# Altium schematic sheet USB_HUB1 UP PORT0.SchDoc: USB_HUB 3.0
size A3; DrawnBy: Luca Schenetti; Revision: A; SheetNumber: 5; SheetTotal: 10
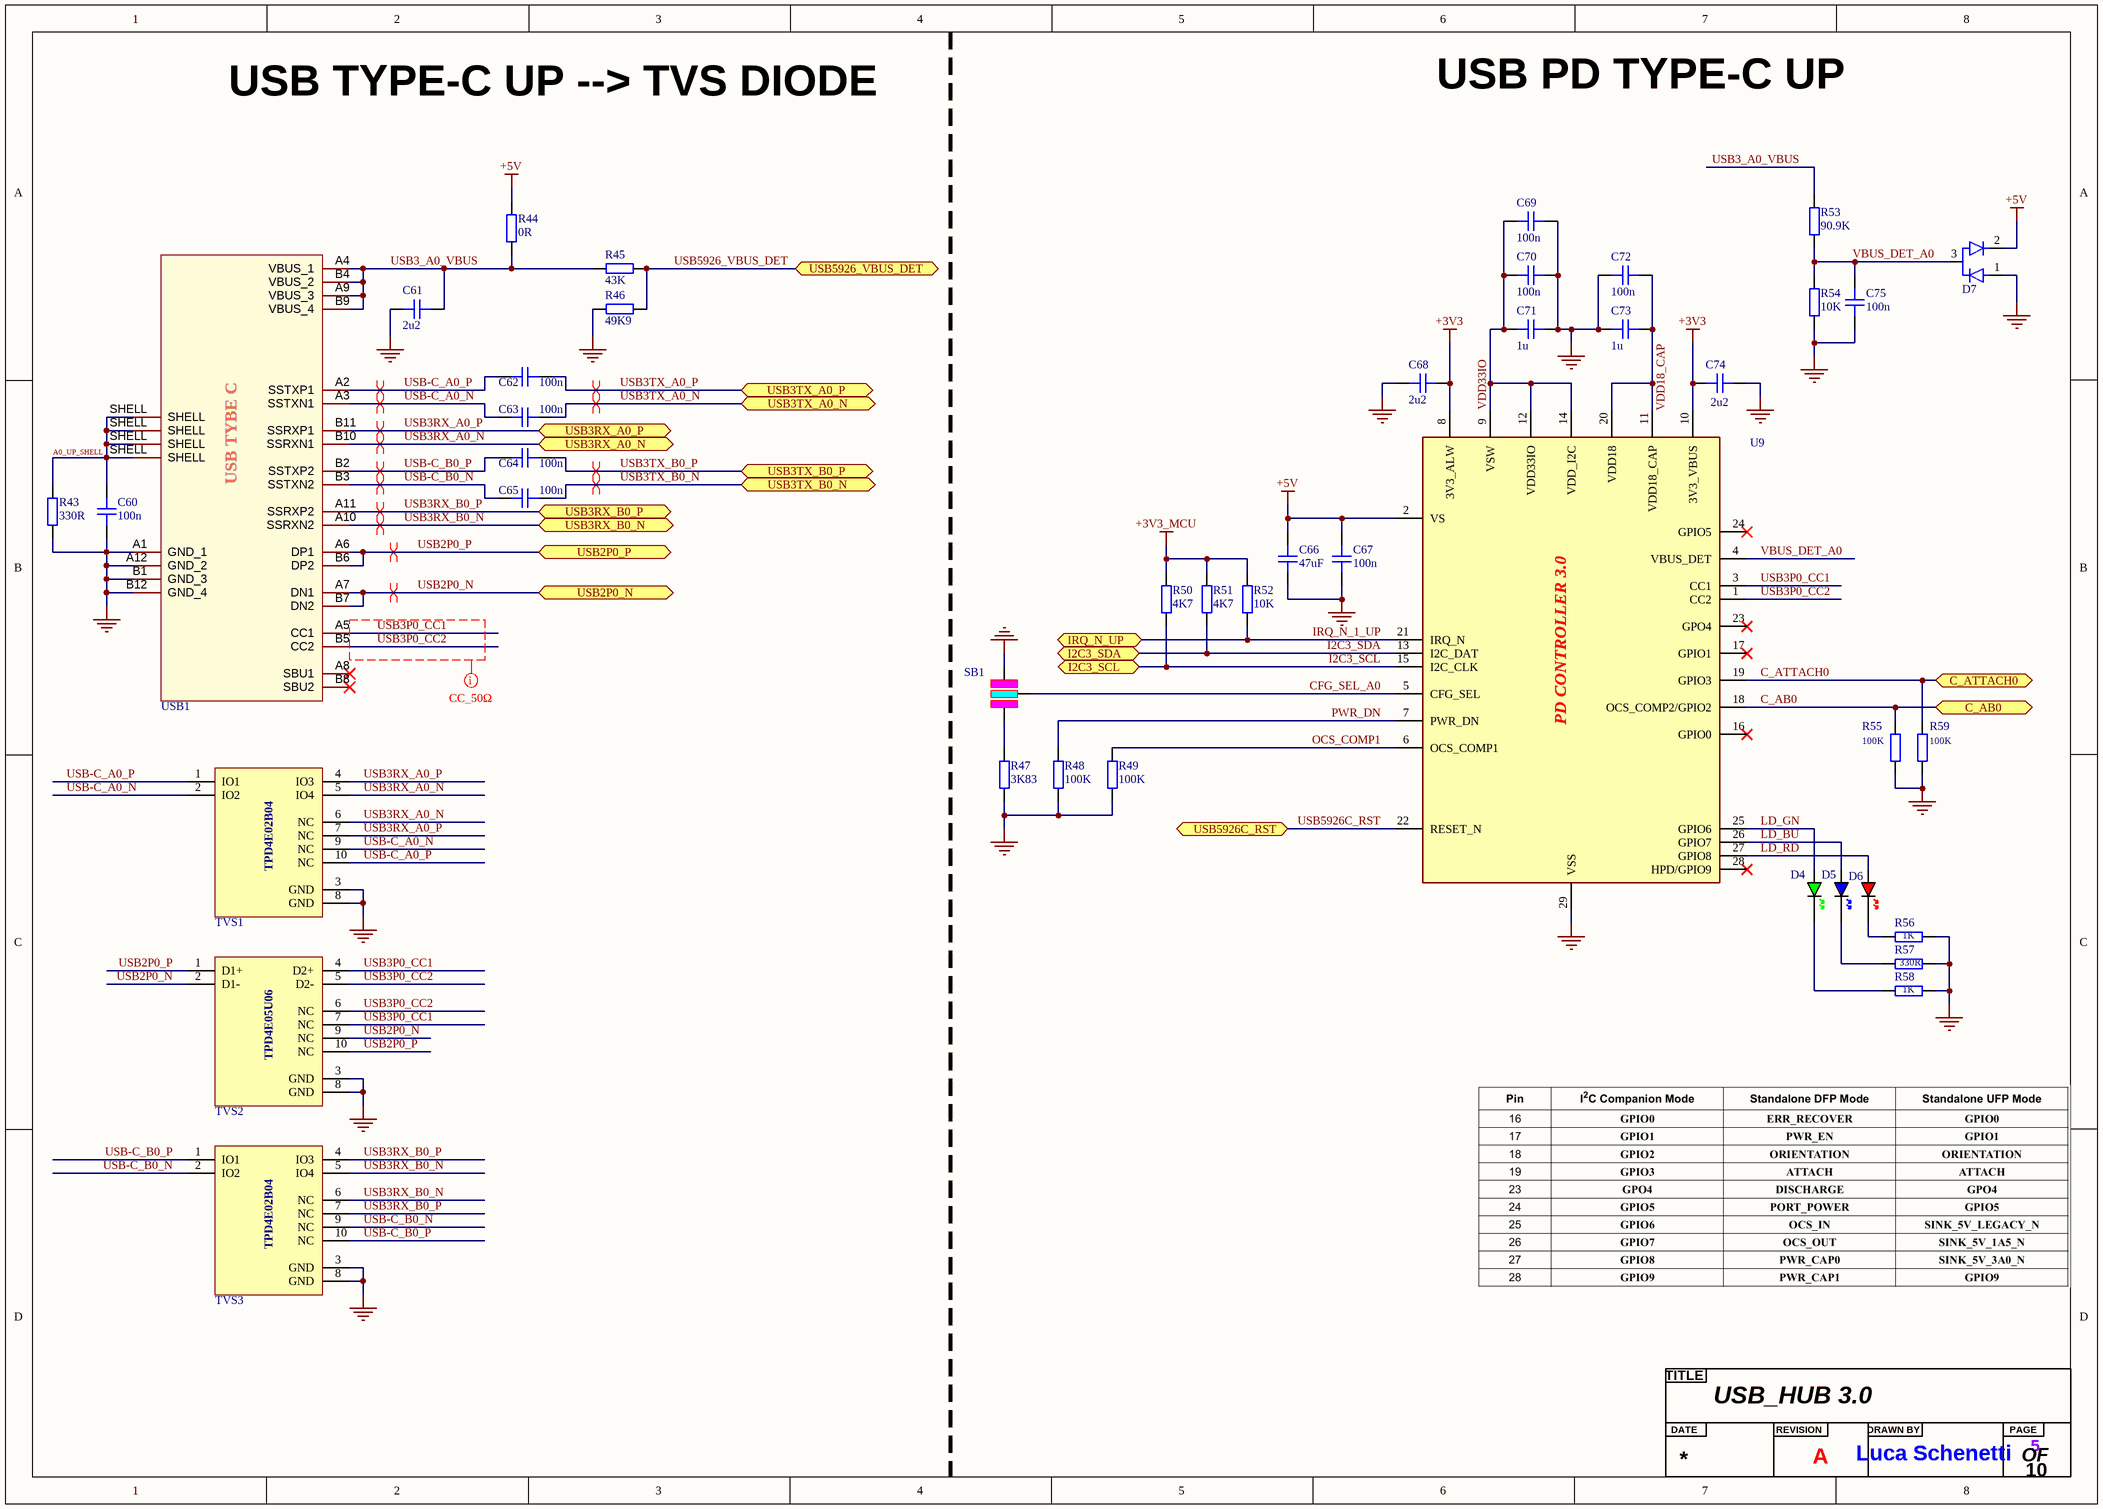
[diagram p0: USB_HUB1 UP PORT0.SchDoc]

## Parts
?  Title  (value not drawn)  (graphical)
C60  100n  [CAP_0603]
C61  2u2  [CAP_0603]
C62  100n  [CAP_0402]
C63  100n  [CAP_0402]
C64  100n  [CAP_0402]
C65  100n  [CAP_0402]
C66  47uF  [CAP_0603]
C67  100n  [CAP_0603]
C68  2u2  [CAP_0603]
C69  100n  [CAP_0603]
C70  100n  [CAP_0603]
C71  1u  [CAP_0603]
C72  100n  [CAP_0603]
C73  1u  [CAP_0603]
C74  2u2  [CAP_0603]
C75  100n  [CAP_0603]
D4  GREEN  [LED_0603_GREEN]  (value not drawn)
D5  BLUE  [LED_0603_BLUE]  (value not drawn)
D6  RED  [LED_0603_RED]  (value not drawn)
D7  High-Speed Switching Diode  [BAV99,215]  (value not drawn)
R43  330R  [RES_0603]
R44  0R  [RES_0603]
R45  43K  [RES_0603]
R46  49K9  [RES_0603]
R47  3K83  [RES_0603]
R48  100K  [RES_0603]
R49  100K  [RES_0603]
R50  4K7  [RES_0603]
R51  4K7  [RES_0603]
R52  10K  [RES_0603]
R53  90.9K  [RES_0603]
R54  10K  [RES_0603]
R55  100K  [RES_0603]
R56  1K  [RES_0603]
R57  330R  [RES_0603]
R58  1K  [RES_0603]
R59  100K  [RES_0603]
SB1  SOLDER BBRIDGE 3W  [SOLDER BRIDBE 3W]  (value not drawn)
TVS1  TVS DIODE USB 3  [TPD4E02B04DQAR]  (value not drawn)
TVS2  ESD and Surge Protection USB, HDMI & High Speed  [TPD4E05U06DQAR]  (value not drawn)
TVS3  TVS DIODE USB 3  [TPD4E02B04DQAR]  (value not drawn)
U9  USB Type-C® PD 3.0 Port Controller  [UPD350AT/Q8X]  (value not drawn)
USB1  TYPE-C 24P QCHT  [TYPE-C 24P QCHT]  (value not drawn)

## Ports
C_AB0 (bidir, see USB_HUB1[3C]), C_ATTACH0 (bidir, see USB_HUB1[3C]), I2C3_SCL (bidir, see MCU[2C], PWR[4B], PWR[11A], USB_HUB1 DN PORT 1_2[5B], USB_HUB1 DN PORT 1_2[5D]), I2C3_SDA (bidir, see MCU[4C], PWR[4B], PWR[11A], USB_HUB1 DN PORT 1_2[5B], USB_HUB1 DN PORT 1_2[5D]), IRQ_N_UP (bidir, see MCU[2C]), USB2P0_N (bidir, see USB_HUB1[3B]), USB2P0_P (bidir, see USB_HUB1[3B]), USB3RX_A0_N (bidir, see USB_HUB1[3B]), USB3RX_A0_P (bidir, see USB_HUB1[3B]), USB3RX_B0_N (bidir, see USB_HUB1[3C]), USB3RX_B0_P (bidir, see USB_HUB1[3C]), USB3TX_A0_N (bidir, see USB_HUB1[3B]), USB3TX_A0_P (bidir, see USB_HUB1[3B]), USB3TX_B0_N (bidir, see USB_HUB1[3C]), USB3TX_B0_P (bidir, see USB_HUB1[3C]), USB5926_VBUS_DET (bidir, see USB_HUB1[3B]), USB5926C_RST (bidir, see MCU[8C], USB_HUB1 DN PORT 1_2[5B], USB_HUB1 DN PORT 1_2[5D], USB_HUB1 DN PORT 5[3D], USB_HUB1 DN PORT 6[1C], USB_HUB1[3C])

## Nets
+3V3: C68.2 C74.2 U9.8(3V3_ALW) U9.10(3V3_VBUS)
+3V3_MCU: R50.2 R51.2 R52.2
+5V: C66.2 C67.2 D7.2 R44.2 U9.2(VS)
GND: C60.1 C61.1 C66.1 C67.1 C68.1 C69.1 C70.1 C71.1 C72.2 C73.1 C74.1 C75.1 D7.1 R43.1 R46.1 R47.1 R48.1 R49.1 R54.1 R55.1 R56.2 R57.2 R58.2 R59.1 SB1.2 TVS1.3(GND) TVS1.8(GND) TVS2.3(GND) TVS2.8(GND) TVS3.3(GND) TVS3.8(GND) U9.29(VSS) USB1.A1(GND_1) USB1.A12(GND_2) USB1.B1(GND_3) USB1.B12(GND_4)
A0_UP_SHELL: C60.2 R43.2 USB1.SHELL
C_AB0: R55.2 U9.18(OCS_COMP2/GPIO2) ; port C_AB0
C_ATTACH0: R59.2 U9.19(GPIO3) ; port C_ATTACH0
CFG_SEL_A0: SB1.1 U9.5(CFG_SEL)
I2C3_SCL: R50.1 U9.15(I2C_CLK) ; port I2C3_SCL
I2C3_SDA: R51.1 U9.13(I2C_DAT) ; port I2C3_SDA
IRQ_N_1_UP: R52.1 U9.21(IRQ_N) ; port IRQ_N_UP
LD_BU: D5.A U9.26(GPIO7)
LD_GN: D4.A U9.25(GPIO6)
LD_RD: D6.A U9.27(GPIO8)
OCS_COMP1: R49.2 U9.6(OCS_COMP1)
PWR_DN: R48.2 U9.7(PWR_DN)
USB2P0_N: TVS2.2(D1-) TVS2.9(NC) USB1.A7(DN1) USB1.B7(DN2) ; port USB2P0_N
USB2P0_P: TVS2.1(D1+) TVS2.10(NC) USB1.A6(DP1) USB1.B6(DP2) ; port USB2P0_P
USB3_A0_VBUS: C61.2 R44.1 R45.1 R53.2 USB1.A4(VBUS_1) USB1.A9(VBUS_3) USB1.B4(VBUS_2) USB1.B9(VBUS_4)
USB3P0_CC1: TVS2.4(D2+) TVS2.7(NC) U9.3(CC1) USB1.A5(CC1)
USB3P0_CC2: TVS2.5(D2-) TVS2.6(NC) U9.1(CC2) USB1.B5(CC2)
USB3RX_A0_N: TVS1.5(IO4) TVS1.6(NC) USB1.B10(SSRXN1) ; port USB3RX_A0_N
USB3RX_A0_P: TVS1.4(IO3) TVS1.7(NC) USB1.B11(SSRXP1) ; port USB3RX_A0_P
USB3RX_B0_N: TVS3.5(IO4) TVS3.6(NC) USB1.A10(SSRXN2) ; port USB3RX_B0_N
USB3RX_B0_P: TVS3.4(IO3) TVS3.7(NC) USB1.A11(SSRXP2) ; port USB3RX_B0_P
USB3TX_A0_N: C63.2 ; port USB3TX_A0_N
USB3TX_A0_P: C62.2 ; port USB3TX_A0_P
USB3TX_B0_N: C65.2 ; port USB3TX_B0_N
USB3TX_B0_P: C64.2 ; port USB3TX_B0_P
USB5926_VBUS_DET: R45.2 R46.2 ; port USB5926_VBUS_DET
USB5926C_RST: U9.22(RESET_N) ; port USB5926C_RST
USB-C_A0_N: C63.1 TVS1.2(IO2) TVS1.9(NC) USB1.A3(SSTXN1)
USB-C_A0_P: C62.1 TVS1.1(IO1) TVS1.10(NC) USB1.A2(SSTXP1)
USB-C_B0_N: C65.1 TVS3.2(IO2) TVS3.9(NC) USB1.B3(SSTXN2)
USB-C_B0_P: C64.1 TVS3.1(IO1) TVS3.10(NC) USB1.B2(SSTXP2)
VBUS_DET_A0: C75.2 D7.3 R53.1 R54.2 U9.4(VBUS_DET)
VDD18_CAP: C72.1 C73.2 U9.11(VDD18_CAP) U9.20(VDD18)
VDD33IO: C69.2 C70.2 C71.2 U9.9(VSW) U9.12(VDD33IO) U9.14(VDD_I2C)
NetD4_K: D4.K R58.1
NetD5_K: D5.K R57.1
NetD6_K: D6.K R56.1
NetR47_2: R47.2 SB1.0

Not connected (* = marked no-connect by the designer): U9 16(GPIO0)* 17(GPIO1)* 23(GPO4)* 24(GPIO5)* 28(HPD/GPIO9)*; USB1 A8(SBU1)* B8(SBU2)*

## Layout directives
differential pair; differential pair class DIFF_USB_90Ω: USB2P0_N, USB2P0_P, USB3RX_A0_N, USB3RX_A0_P, USB3RX_B0_N, USB3RX_B0_P, USB3TX_A0_N, USB3TX_A0_P, USB3TX_B0_N, USB3TX_B0_P, USB-C_A0_N, USB-C_A0_P, USB-C_B0_N, USB-C_B0_P
net class CC_50Ω: USB3P0_CC1, USB3P0_CC2

## Notes on the sheet
- USB TYPE-C UP --> TVS DIODE
- USB PD TYPE-C UP
- (near SB1) Companion Mode
  I2C Slave Address = 1011_111
- I2C Slave Address = 1011_111
  UFP STANDALONE
- (in symbol Title) TITLE; DATE; REVISION; DRAWN BY; PAGE; OF
- (in symbol TPD4E02B04DQAR) TPD4E02B04
- (in symbol TPD4E05U06DQAR) TPD4E05U06
- (in symbol TYPE-C 24P QCHT) USB TYBE C
- (in symbol UPD350AT/Q8X) PD CONTROLLER 3.0

## Library data of the parts
C60 C67 C69 C70 C72 C75 = CAP_0603: Capacitor SMD 0603 [C14663]; Manufacturer: *; Manufacturer Part Number: *; Distributor Link: *; LCSC: *; Rating: *; Dielectric: *
C61 C68 C74 = CAP_0603: Capacitor SMD 0603 [C23630]; Manufacturer: *; Manufacturer Part Number: *; Distributor Link: *; LCSC: *; Rating: *; Dielectric: *
C62-C65 = CAP_0402: Capacitor SMD 0402[C1525]; Manufacturer: *; Manufacturer Part Number: *; Distributor Link: *; LCSC: *; Rating: *; Dielectric: *
C66 = CAP_0603: Capacitor SMD 0603 [C730416]; Manufacturer: *; Manufacturer Part Number: *; Distributor Link: *; LCSC: *; Rating: *; Dielectric: *
C71 C73 = CAP_0603: Capacitor SMD 0603 [C15849]; Manufacturer: *; Manufacturer Part Number: *; Distributor Link: *; LCSC: *; Rating: *; Dielectric: *
D4 = LED_0603_GREEN: [C2986059]
D5 = LED_0603_BLUE: [C84266]
D6 = LED_0603_RED: [C2286]
D7 = BAV99,215: [C2500]
R43 R57 = RES_0603: [C23138]; Manufacturer: *; Manufacturer Part Number: *; Distributor Link: *; LCSC: *
R44 = RES_0603: [C21189]; Manufacturer: *; Manufacturer Part Number: *; Distributor Link: *; LCSC: *
R45 = RES_0603: [C23172]; Manufacturer: *; Manufacturer Part Number: *; Distributor Link: *; LCSC: *
R46 = RES_0603: [C23184]; Manufacturer: *; Manufacturer Part Number: *; Distributor Link: *; LCSC: *
R47 = RES_0603: [C22982]; Manufacturer: *; Manufacturer Part Number: *; Distributor Link: *; LCSC: *
R48 R49 R55 R59 = RES_0603: [C25803]; Manufacturer: *; Manufacturer Part Number: *; Distributor Link: *; LCSC: *
R50 R51 = RES_0603: Resistor SMD 0603[C23162]; Manufacturer: *; Manufacturer Part Number: *; Distributor Link: *; LCSC: *
R52 = RES_0603: Resistor SMD 0603[C25804]; Manufacturer: *; Manufacturer Part Number: *; Distributor Link: *; LCSC: *
R53 = RES_0603: [C23129]; Manufacturer: *; Manufacturer Part Number: *; Distributor Link: *; LCSC: *
R54 = RES_0603: [C25804]; Manufacturer: *; Manufacturer Part Number: *; Distributor Link: *; LCSC: *
R56 R58 = RES_0603: [C21190]; Manufacturer: *; Manufacturer Part Number: *; Distributor Link: *; LCSC: *
TVS1 TVS3 = TPD4E02B04DQAR: [C106794]
TVS2 = TPD4E05U06DQAR: [C138714]
U9 = UPD350AT/Q8X: [C622602]
USB1 = TYPE-C 24P QCHT: [C456013]